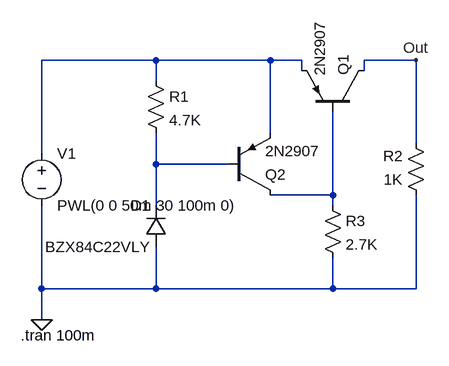
[diagram p0: schematic ovp.asc]
ovp.asc, the LTspice schematic file:
Version 4.1
SHEET 1 880 680
WIRE -304 -240 -480 -240
WIRE -128 -240 -304 -240
WIRE -80 -240 -128 -240
WIRE 96 -240 16 -240
WIRE -80 -224 -80 -240
WIRE 16 -224 16 -240
WIRE -304 -208 -304 -240
WIRE -128 -128 -128 -240
WIRE 96 -112 96 -240
WIRE -480 -96 -480 -240
WIRE -304 -80 -304 -128
WIRE -192 -80 -304 -80
WIRE -32 -32 -32 -160
WIRE -32 -32 -128 -32
WIRE -304 -16 -304 -80
WIRE -32 -16 -32 -32
WIRE -480 112 -480 -16
WIRE -304 112 -304 48
WIRE -304 112 -480 112
WIRE -32 112 -32 64
WIRE -32 112 -304 112
WIRE 96 112 96 -32
WIRE 96 112 -32 112
WIRE -480 160 -480 112
FLAG -480 160 0
FLAG 96 -240 Out
SYMBOL voltage -480 -112 R0
WINDOW 123 0 0 Left 0
WINDOW 39 0 0 Left 0
SYMATTR InstName V1
SYMATTR Value PWL(0 0 50m 30 100m 0)
SYMBOL res -320 -224 R0
SYMATTR InstName R1
SYMATTR Value 4.7K
SYMBOL res 112 -16 R180
WINDOW 0 36 76 Left 2
WINDOW 3 36 40 Left 2
SYMATTR InstName R2
SYMATTR Value 1K
SYMBOL diode -288 48 R180
WINDOW 0 24 64 Left 2
WINDOW 3 24 0 Left 2
SYMATTR InstName D1
SYMATTR Value BZX84C22VLY
SYMBOL pnp -192 -32 M180
SYMATTR InstName Q2
SYMATTR Value 2N2907
SYMBOL res -48 -32 R0
SYMATTR InstName R3
SYMATTR Value 2.7K
SYMBOL pnp 16 -160 M270
SYMATTR InstName Q1
SYMATTR Value 2N2907
TEXT -512 184 Left 2 !.tran 100m

The netlist it stands for:
* ovp.asc
V1 N001 0 PWL(0 0 50m 30 100m 0)
R1 N001 N002 4.7K
R2 0 Out 1K
D1 0 N002 BZX84C22VLY
Q2 N003 N002 N001 0 2N2907
R3 N003 0 2.7K
Q1 Out N003 N001 0 2N2907
.model D D
.lib standard.dio
.model NPN NPN
.model PNP PNP
.lib standard.bjt
.tran 100m
.backanno
.end